# Altium schematic sheet PCM1822Q1.SchDoc
size Letter; SheetNumber: 2; SheetTotal: 2
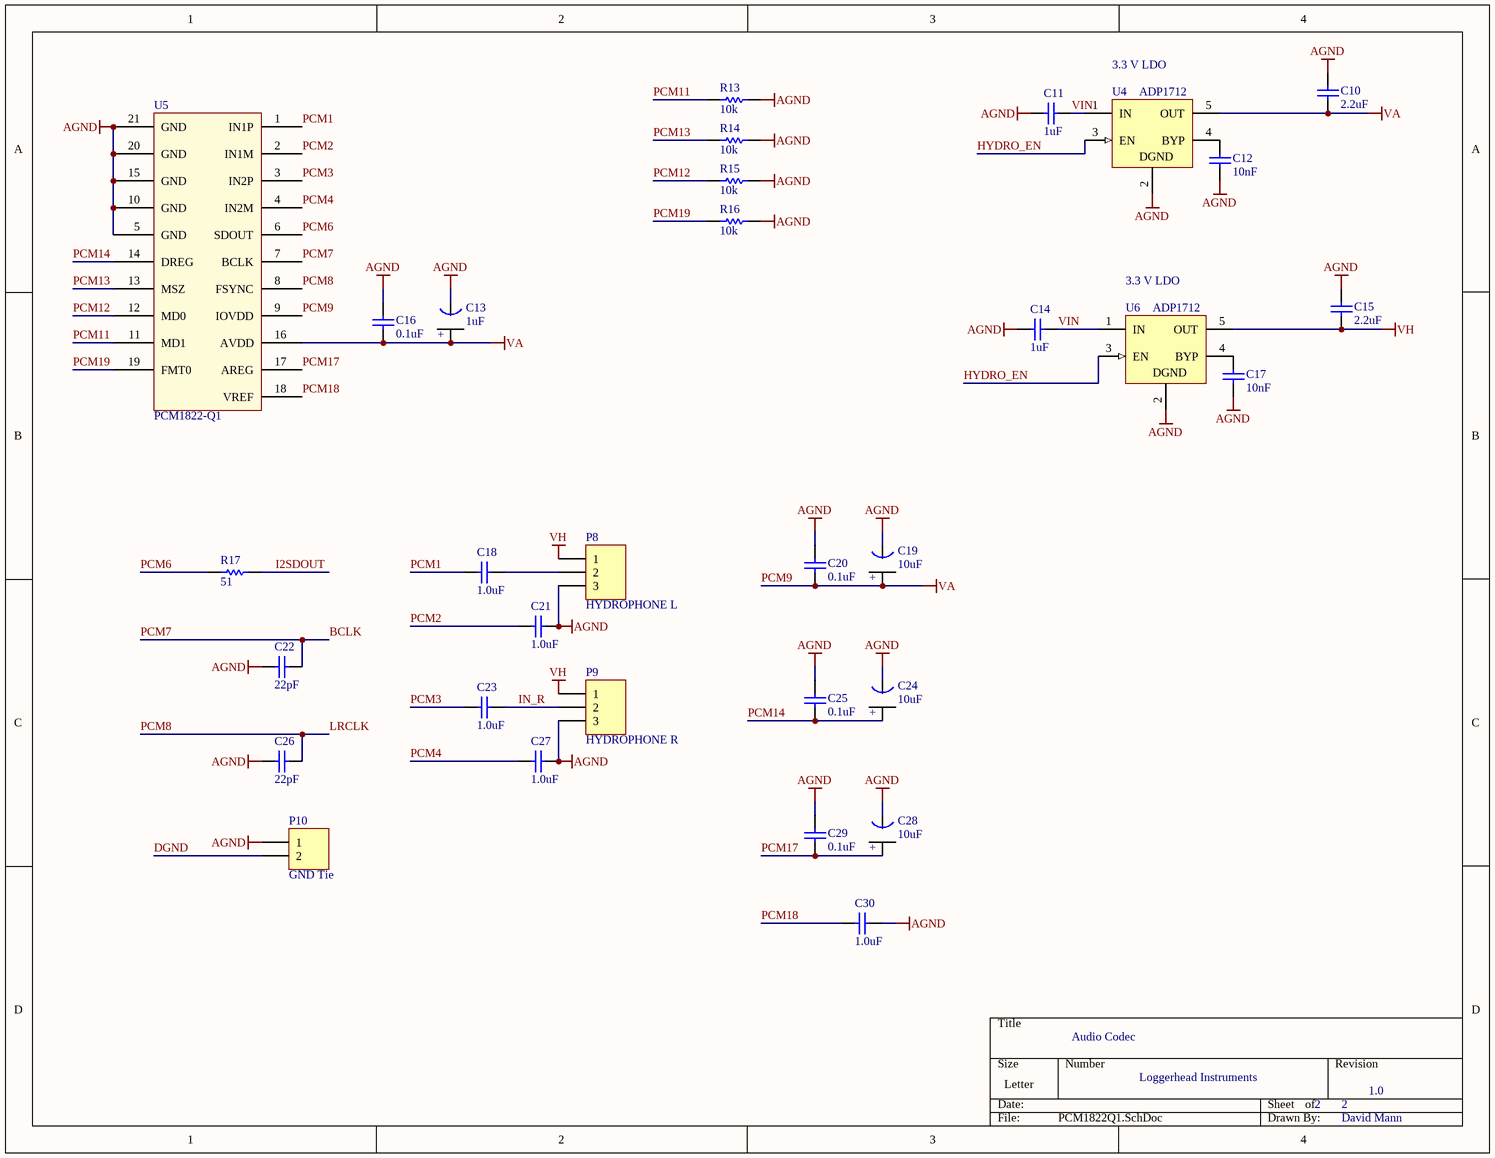
[diagram p0: PCM1822Q1.SchDoc]

## Parts
C10  2.2uF  [0402]
C11  1uF  [0402]
C12  10nF  [0402]
C13  1uF  [Tant0805]
C14  1uF  [0402]
C15  2.2uF  [0402]
C16  0.1uF  [0402]
C17  10nF  [0402]
C18  1.0uF  [0402]
C19  10uF  [Tant0805]
C20  0.1uF  [0402]
C21  1.0uF  [0402]
C22  22pF  [0402]
C23  1.0uF  [0402]
C24  10uF  [Tant0805]
C25  0.1uF  [0402]
C26  22pF  [0402]
C27  1.0uF  [0402]
C28  10uF  [Tant0805]
C29  0.1uF  [0402]
C30  1.0uF  [0402]
P8  HYDROPHONE L  [HDR1X3]
P9  HYDROPHONE R  [HDR1X3]
P10  GND Tie  [HDR1X2]
R13  10k  [3-0603]
R14  10k  [3-0603]
R15  10k  [3-0603]
R16  10k  [3-0603]
R17  51  [3-0603]
U4  ADP1712  [MF05A_N]
U5  PCM1822-Q1  [PCM1822-Q1]
U6  ADP1712  [MF05A_N]

## Nets
AGND: C10.2 C11.2 C12.2 C13.1(GND) C14.2 C15.2 C16.1 C17.2 C19.1(GND) C20.1 C21.1 C22.1 C24.1(GND) C25.1 C26.1 C27.1 C28.1(GND) C29.1 C30.1 P8.3 P9.3 P10.1 R13.2 R14.2 R15.2 R16.2 U4.2(GND) U5.5(GND) U5.10(GND) U5.15(GND) U5.20(GND) U5.21(GND) U6.2(GND)
PCM9: C10.1 C13.2(+) C16.2 C19.2(+) C20.2 U4.5(OUT) U5.9(IOVDD) U5.16(AVDD)  [also labelled VA]
VH: C15.1 P8.1 P9.1 U6.5(OUT)
BCLK: C22.2 U5.7(BCLK)  [also labelled PCM7]
DGND: P10.2
HYDRO_EN: U4.3(EN) U6.3(EN)
I2SDOUT: R17.2
IN_R: C23.1 P9.2
LRCLK: C26.2 U5.8(FSYNC)  [also labelled PCM8]
PCM1: C18.2 U5.1(IN1P)
PCM2: C21.2 U5.2(IN1M)
PCM3: C23.2 U5.3(IN2P)
PCM4: C27.2 U5.4(IN2M)
PCM6: R17.1 U5.6(SDOUT)
PCM11: R13.1 U5.11(MD1)
PCM12: R15.1 U5.12(MD0)
PCM13: R14.1 U5.13(MSZ)
PCM14: C24.2(+) C25.2 U5.14(DREG)
PCM17: C28.2(+) C29.2 U5.17(AREG)
PCM18: C30.2 U5.18(VREF)
PCM19: R16.1 U5.19(FMT0)
VIN: C11.1 C14.1 U4.1(IN) U6.1(IN)
NetC12_1: C12.1 U4.4(BYP)
NetC17_1: C17.1 U6.4(BYP)
NetC18_1: C18.1 P8.2

## Notes on the sheet
- (near U4) 3.3 V LDO
- (near U6) 3.3 V LDO
- Audio Codec
- Loggerhead Instruments
- 2
- 1.0
- David Mann
- (in symbol LP3985IM5-3.3) DGND

## Library data of the parts
C10-C12 C14 C15 C17 C18 C21-C23 C26 C27 C30 = C0402: Ceramic Chip Capacitor - Standard; Note: Footprint corresponds to dimensions for bulk cassette packaging. This case size has tightened tolerances.; Value: 0.1uF; Published: 17-Jul-2002; LatestRevisionDate: 19-Mar-2004; LatestRevisionNote: Silkscreen size reduced.; DatasheetDocument: Mar-2001; PackageDocument: Mar-2001; PackageReference: 0402; Publisher: Altium Limited; Code_JEITA: 0402; Code_IPC: 1005 [0402]; ComponentLink1Description: Manufacturer Link; ComponentLink1URL: http://www.kemet.com/; ComponentLink2Description: Datasheet; ComponentLink2URL: http://www.kemet.com/kemet/web/homepage/kechome.nsf/vapubfilesname/F3102TA.pdf/$file/F3102TA.pdf
C13 = Tant0805: Value: 10uF
C16 C20 C25 C29 = C0402: Ceramic Chip Capacitor - Standard; Note: Footprint corresponds to dimensions for bulk cassette packaging. This case size has tightened tolerances.; Published: 17-Jul-2002; LatestRevisionDate: 19-Mar-2004; LatestRevisionNote: Silkscreen size reduced.; DatasheetDocument: Mar-2001; PackageDocument: Mar-2001; PackageReference: 0402; Publisher: Altium Limited; Code_JEITA: 0402; Code_IPC: 1005 [0402]; ComponentLink1Description: Manufacturer Link; ComponentLink1URL: http://www.kemet.com/; ComponentLink2Description: Datasheet; ComponentLink2URL: http://www.kemet.com/kemet/web/homepage/kechome.nsf/vapubfilesname/F3102TA.pdf/$file/F3102TA.pdf; Value: 0.1uF
C19 C24 C28 = Tant0805: Value: 10uF
P8 P9 = Header 3: Header, 3-Pin; LatestRevisionDate: 17-Jul-2002; LatestRevisionNote: Re-released for DXP Platform.; Publisher: Altium Limited
P10 = Header 2: Header, 2-Pin; LatestRevisionDate: 17-Jul-2002; LatestRevisionNote: Re-released for DXP Platform.; Publisher: Altium Limited
R13-R17 = ERJ3RK: Precision Thick Film Chip Resistor, 10 Ohm to 1M Ohm Range, 1% and 0.5% Tolerance, 0603 Size, 0.063 W; Published: 17-Dec-2003; LatestRevisionDate: 19-Mar-2004; LatestRevisionNote: Silkscreen size reduced.; PackageDocument: Mar-2003; PackageReference: 3-0603; Publisher: Altium Limited; Code_IPC: 1608 [0603]; ComponentLink1Description: Manufacturer Link; ComponentLink1URL: http://www.panasonic.com/industrial/components/resistive_products.htm; ComponentLink2Description: Datasheet; ComponentLink2URL: http://www.panasonic.com/industrial/components/pdf/AOA0000CE2.pdf
U4 U6 = LP3985IM5-3.3: Micropower, 150mA Low-Noise Ultra Low-Dropout CMOS Voltage Regulator; Manufacturer: National Semiconductor; CompType: LDO IC; PackageTopMarking: LDQB*XTT; PowerWise: N; Published: 4-Dec-2008; DatasheetVersion: Aug-2005; PackageVersion: revD, Aug-2008; PackageReference: MF05A; Publisher: Altium Limited; PackageDescription: Molded SOT-23, .115 x .063 x .040 in Body, 5 Lead, .0375 in Pitch; PartNumber: LP3985IM5-3.3; RoHS: O; PinCount: 5; DigiKeyPartNumber: LP3985IM5-3.3CT-ND; ComponentLink1Description: LP3985 Datasheet; ComponentLink1URL: http://www.national.com/ds/LP/LP3985.pdf; ComponentLink2Description: LP3985 Web Page; ComponentLink2URL: http://www.national.com/pf/LP/LP3985.html; ComponentLink3Description: MF05A Package Page; ComponentLink3URL: http://www.national.com/packaging/folders/mf05a.html
U5 = PCM1822-Q1: TI PCM1822-Q1 Stereo Channel, 32-Bit, 192-kHz, Burr-Brown Audio ADC